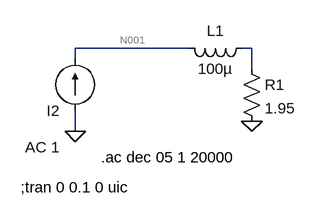
[diagram p0: schematic Draft1.asc]
Draft1.asc, the LTspice schematic file:
Version 4
SHEET 1 880 680
WIRE 144 160 -32 160
WIRE 240 160 224 160
WIRE -32 176 -32 160
WIRE 240 192 240 160
WIRE -32 288 -32 256
FLAG -32 288 0
FLAG 240 272 0
SYMBOL ind 240 144 R90
WINDOW 0 5 56 VBottom 2
WINDOW 3 32 56 VTop 2
SYMATTR InstName L1
SYMATTR Value 100µ
SYMBOL current -32 256 R180
WINDOW 3 24 -28 Left 2
WINDOW 123 24 -56 Left 2
WINDOW 39 0 0 Left 0
SYMATTR InstName I2
SYMATTR Value ""
SYMATTR Value2 AC 1
SYMBOL res 224 176 R0
SYMATTR InstName R1
SYMATTR Value 1.95
TEXT -116 374 Left 2 !;tran 0 0.1 0 uic
TEXT 8 328 Left 2 !.ac dec 05 1 20000

The netlist it stands for:
* Draft1.asc
L1 N002 N001 100µ
I2 0 N001 AC 1
R1 N002 0 1.95
;tran 0 0.1 0 uic
.ac dec 05 1 20000
.backanno
.end

* Results of the author's LTspice run, read from the files saved beside the schematic
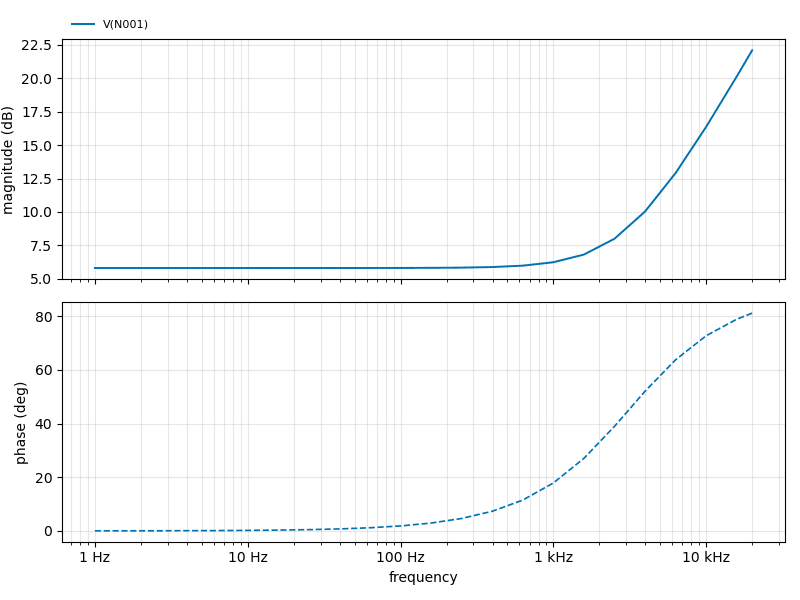
[diagram p1: AC Analysis of Draft1.asc, plotted from the saved traces]
* AC Analysis, 1 run:
*   V(N001): 5.81 dB at 1 Hz, 22.09 dB at 20 kHz, peak 22.09 dB at 20 kHz, 3 dB below the peak at 13.94 kHz